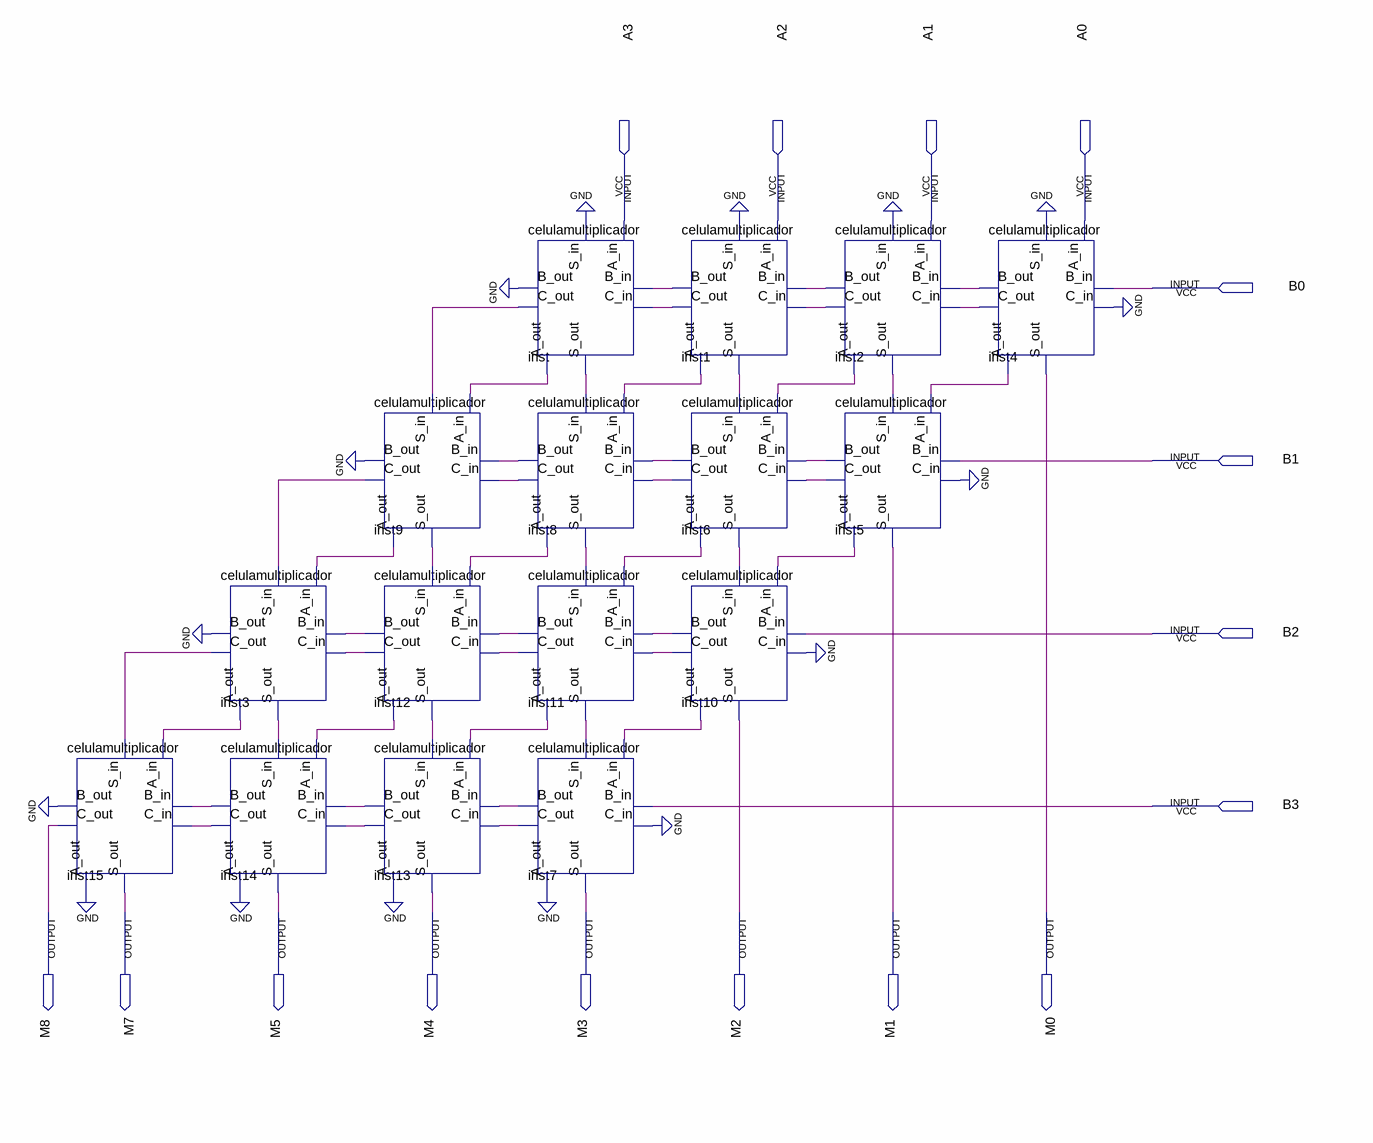
[diagram p0: schematic sheet]
// Quartus schematic multiplicadorquatrobits.bdf as structural Verilog: 16 symbols, 16 pins
module multiplicadorquatrobits (
  input  A3,
  input  A2,
  input  A1,
  input  A0,
  input  B0,
  input  B1,
  input  B2,
  input  B3,
  output M8,
  output M7,
  output M5,
  output M4,
  output M3,
  output M2,
  output M1,
  output M0
);

  wire inst1_a_out, inst1_b_out, inst1_c_out, inst1_s_out, inst2_a_out, inst2_b_out, inst2_c_out,
       inst2_s_out, inst3_a_out, inst3_b_out, inst3_c_out, inst3_s_out, inst4_a_out, inst4_b_out,
       inst4_c_out, inst5_a_out, inst5_b_out, inst5_c_out, inst6_a_out, inst6_b_out, inst6_c_out,
       inst6_s_out, inst7_a_out, inst7_b_out, inst7_c_out, inst8_a_out, inst8_b_out, inst8_c_out,
       inst8_s_out, inst9_a_out, inst9_b_out, inst9_c_out, inst9_s_out, inst10_a_out, inst10_b_out,
       inst10_c_out, inst11_a_out, inst11_b_out, inst11_c_out, inst11_s_out, inst12_a_out, inst12_b_out,
       inst12_c_out, inst12_s_out, inst13_a_out, inst13_b_out, inst13_c_out, inst14_a_out, inst14_b_out,
       inst14_c_out, inst15_a_out, inst15_b_out, inst_a_out, inst_b_out, inst_c_out, inst_s_out;

  celulamultiplicador inst15 (
    .A_in(inst3_a_out), .S_in(inst3_c_out), .B_in(inst14_b_out), .C_in(inst14_c_out), .B_out(inst15_b_out),
    .C_out(M8), .S_out(M7), .A_out(inst15_a_out));
  celulamultiplicador inst3 (
    .A_in(inst9_a_out), .S_in(inst9_c_out), .B_in(inst12_b_out), .C_in(inst12_c_out), .B_out(inst3_b_out),
    .C_out(inst3_c_out), .S_out(inst3_s_out), .A_out(inst3_a_out));
  celulamultiplicador inst14 (
    .A_in(inst12_a_out), .S_in(inst3_s_out), .B_in(inst13_b_out), .C_in(inst13_c_out), .B_out(inst14_b_out),
    .C_out(inst14_c_out), .S_out(M5), .A_out(inst14_a_out));
  celulamultiplicador inst9 (
    .A_in(inst_a_out), .S_in(inst_c_out), .B_in(inst8_b_out), .C_in(inst8_c_out), .B_out(inst9_b_out),
    .C_out(inst9_c_out), .S_out(inst9_s_out), .A_out(inst9_a_out));
  celulamultiplicador inst12 (
    .A_in(inst8_a_out), .S_in(inst9_s_out), .B_in(inst11_b_out), .C_in(inst11_c_out), .B_out(inst12_b_out),
    .C_out(inst12_c_out), .S_out(inst12_s_out), .A_out(inst12_a_out));
  celulamultiplicador inst13 (
    .A_in(inst11_a_out), .S_in(inst12_s_out), .B_in(inst7_b_out), .C_in(inst7_c_out), .B_out(inst13_b_out),
    .C_out(inst13_c_out), .S_out(M4), .A_out(inst13_a_out));
  celulamultiplicador inst (
    .A_in(A3), .S_in(1'b0), .B_in(inst1_b_out), .C_in(inst1_c_out), .B_out(inst_b_out), .C_out(inst_c_out),
    .S_out(inst_s_out), .A_out(inst_a_out));
  celulamultiplicador inst8 (
    .A_in(inst1_a_out), .S_in(inst_s_out), .B_in(inst6_b_out), .C_in(inst6_c_out), .B_out(inst8_b_out),
    .C_out(inst8_c_out), .S_out(inst8_s_out), .A_out(inst8_a_out));
  celulamultiplicador inst11 (
    .A_in(inst6_a_out), .S_in(inst8_s_out), .B_in(inst10_b_out), .C_in(inst10_c_out), .B_out(inst11_b_out),
    .C_out(inst11_c_out), .S_out(inst11_s_out), .A_out(inst11_a_out));
  celulamultiplicador inst7 (
    .A_in(inst10_a_out), .S_in(inst11_s_out), .B_in(B3), .C_in(1'b0), .B_out(inst7_b_out),
    .C_out(inst7_c_out), .S_out(M3), .A_out(inst7_a_out));
  celulamultiplicador inst1 (
    .A_in(A2), .S_in(1'b0), .B_in(inst2_b_out), .C_in(inst2_c_out), .B_out(inst1_b_out), .C_out(inst1_c_out),
    .S_out(inst1_s_out), .A_out(inst1_a_out));
  celulamultiplicador inst6 (
    .A_in(inst2_a_out), .S_in(inst1_s_out), .B_in(inst5_b_out), .C_in(inst5_c_out), .B_out(inst6_b_out),
    .C_out(inst6_c_out), .S_out(inst6_s_out), .A_out(inst6_a_out));
  celulamultiplicador inst10 (
    .A_in(inst5_a_out), .S_in(inst6_s_out), .B_in(B2), .C_in(1'b0), .B_out(inst10_b_out),
    .C_out(inst10_c_out), .S_out(M2), .A_out(inst10_a_out));
  celulamultiplicador inst2 (
    .A_in(A1), .S_in(1'b0), .B_in(inst4_b_out), .C_in(inst4_c_out), .B_out(inst2_b_out), .C_out(inst2_c_out),
    .S_out(inst2_s_out), .A_out(inst2_a_out));
  celulamultiplicador inst5 (
    .A_in(inst4_a_out), .S_in(inst2_s_out), .B_in(B1), .C_in(1'b0), .B_out(inst5_b_out), .C_out(inst5_c_out),
    .S_out(M1), .A_out(inst5_a_out));
  celulamultiplicador inst4 (
    .A_in(A0), .S_in(1'b0), .B_in(B0), .C_in(1'b0), .B_out(inst4_b_out), .C_out(inst4_c_out), .S_out(M0),
    .A_out(inst4_a_out));
  // also tied to GND on the sheet: {inst15_b_out, inst15_a_out, inst3_b_out, inst14_a_out, inst9_b_out, inst13_a_out, inst_b_out, inst7_a_out}
endmodule
